# Altium schematic sheet LCD.SchDoc
size A
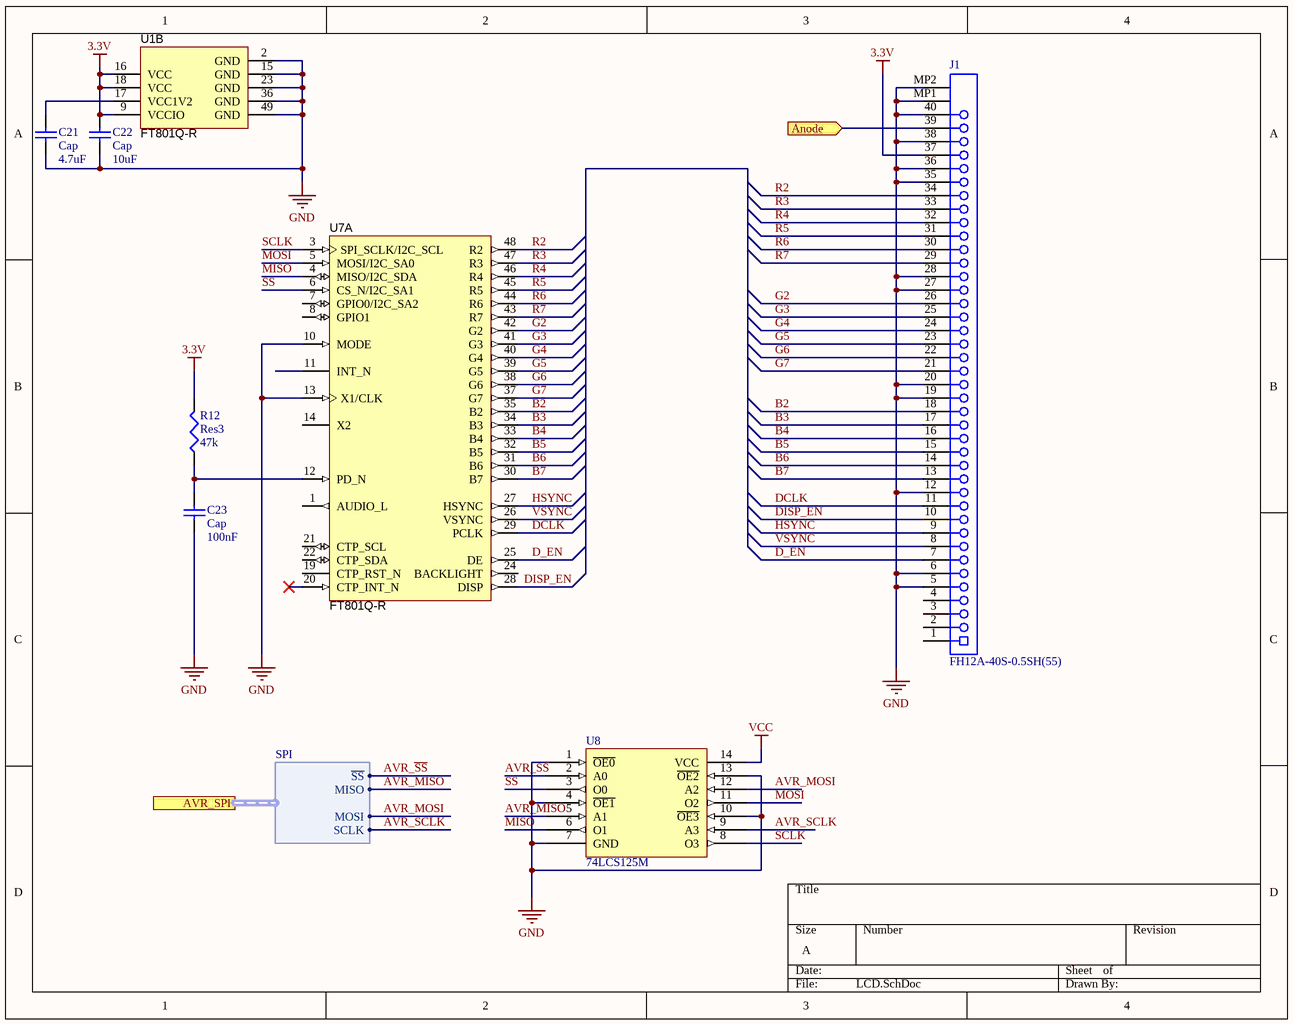
[diagram p0: LCD.SchDoc]

## Parts
C21  Cap  value 4.7uF  [C0805]
C22  Cap  value 10uF  [1608[0603]]
C23  Cap  value 100nF  [C0805]
J1  FH12A-40S-0.5SH(55)  [HIRO-FH12A-40S-0.5SH(55)_V]
R12  Res3  value 47k  [J1-0603]
U1  FT801Q-R  [WQFN-48]  (part B of 2)
U7  FT801Q-R  [WQFN-48]  (part A of 2)
U8  74LCS125M  [SOIC127P780X210-14M]

## Ports
Anode (in), AVR_SPI (harness SPI)

## Harnesses
SPI: ~{SS}, MISO, MOSI, SCLK

## Nets
3.3V: C22.1 J1.37 R12.2 U1.9(VCCIO) U1.16(VCC) U1.18(VCC)
GND: C21.1 C22.2 C23.1 J1.5 J1.6 J1.12 J1.19 J1.20 J1.27 J1.28 J1.35 J1.36 J1.38 J1.40 J1.MP1 J1.MP2 U1.2(GND) U1.15(GND) U1.23(GND) U1.36(GND) U1.49(GND) U7.10(MODE) U7.13(X1/CLK) U8.1(~{OE0}) U8.4(~{OE1}) U8.7(GND) U8.10(~{OE3}) U8.13(~{OE2})
VCC: U8.14(VCC)
Anode: J1.39 ; port Anode
AVR_MISO: U8.5(A1) ; port AVR_SPI.MISO
AVR_MOSI: U8.12(A2) ; port AVR_SPI.MOSI
AVR_~{SS}: U8.2(A0) ; port AVR_SPI.~{SS}
AVR_SCLK: U8.9(A3) ; port AVR_SPI.SCLK
B2: J1.18 U7.35(B2)
B3: J1.17 U7.34(B3)
B4: J1.16 U7.33(B4)
B5: J1.15 U7.32(B5)
B6: J1.14 U7.31(B6)
B7: J1.13 U7.30(B7)
D_EN: J1.7 U7.25(DE)
DCLK: J1.11 U7.29(PCLK)
DISP_EN: J1.10 U7.28(DISP)
G2: J1.26 U7.42(G2)
G3: J1.25 U7.41(G3)
G4: J1.24 U7.40(G4)
G5: J1.23 U7.39(G5)
G6: J1.22 U7.38(G6)
G7: J1.21 U7.37(G7)
HSYNC: J1.9 U7.27(HSYNC)
MISO: U7.4(MISO/I2C_SDA) U8.6(O1)
MOSI: U7.5(MOSI/I2C_SA0) U8.11(O2)
R2: J1.34 U7.48(R2)
R3: J1.33 U7.47(R3)
R4: J1.32 U7.46(R4)
R5: J1.31 U7.45(R5)
R6: J1.30 U7.44(R6)
R7: J1.29 U7.43(R7)
~{SS}: U7.6(CS_N/I2C_SA1) U8.3(O0)
SCLK: U7.3(SPI_SCLK/I2C_SCL) U8.8(O3)
VSYNC: J1.8 U7.26(VSYNC)
NetC21_2: C21.2 U1.17(VCC1V2)
NetC23_2: C23.2 R12.1 U7.12(PD_N)

Not connected (* = marked no-connect by the designer): J1 1 2 3 4; U7 1(AUDIO_L) 7(GPIO0/I2C_SA2) 8(GPIO1) 11(INT_N) 14(X2) 19(CTP_RST_N) 20(CTP_INT_N)* 21(CTP_SCL) 22(CTP_SDA) 24(BACKLIGHT)

## Library data of the parts
C21-C23 = Cap: Capacitor; Published: 8-Jun-2000; LatestRevisionDate: 17-Jul-2002; LatestRevisionNote: Re-released for DXP Platform.; PackageReference: RAD-0.3; Publisher: Altium Limited; PackageDescription: Radial Cap, Thru-Hole; 2 Leads; 0.3 in Pin Spacing
J1 = CMP-2000-06268-1: Flip Lock Conncetor for FPC/FFC, 1 x 40 Position, Pitch 0.5 mm, -40 to 70 degC, SMD, RoHS, Tape and Reel; Manufacturer: Hirose Electric; Pitch: 0.5mm; Style/Orientation: RightAngleSocket/Receptacle; No of Positions: 40; Package Description: Female Header, Pitch 0.5 mm, 1 x 40 Position, Height 2 mm; Datasheet Version: 10/2006; Termination: Solder; Manufacturer URL: https://www.hirose.com; Mounting Technology: SurfaceMount; Type: FFC/FPC; Package Reference: FH12A-40S-0.5SH(55); Datasheet URL: https://datasheet.ciiva.com/14667/0900766b80806912-14667338.pdf
R12 = Res3: Resistor; Published: 8-Jun-2000; LatestRevisionDate: 29-May-2009; LatestRevisionNote: IPC-7351 Footprint Added.; PackageReference: J1-0603; Publisher: Altium Limited; PackageDescription: Chip Resistor
U1 U7 = CMP-0582-00009-1: FT801 Single Chip Embedded Graphic Controller (Embedded Video Engine), -40 to +85 degC, 48-pin VQFN, Pb-Free, Tape and Reel; Manufacturer: FTDI; PackageReference: WQFN-48; ComponentLink1URL: http://www.ftdichip.com/; PackageDescription: 48-Pin Quad Flat No-Lead, 7 x 7 mm Body, 0.5 mm Pitch, 5.36 x 5.36 mm Exposed Pad; ComponentLink1Description: Manufacturer URL; ComponentLink2URL: http://www.ftdichip.com/Support/Documents/DataSheets/ICs/DS_FT801.pdf; DatasheetVersion: ver 1.0, Jul-2014; ComponentLink2Description: Datasheet
  U1: PartId: 2
U8 = 74LCS125M: Low Voltage Quad Buffer with 5V tolerant Inputs and Outputs; ComponentLink1Description: Digikey Link; ComponentLink1URL: https://www.digikey.com/product-detail/en/on-semiconductor/74LCX125MX/74LCX125MXCT-ND/965496